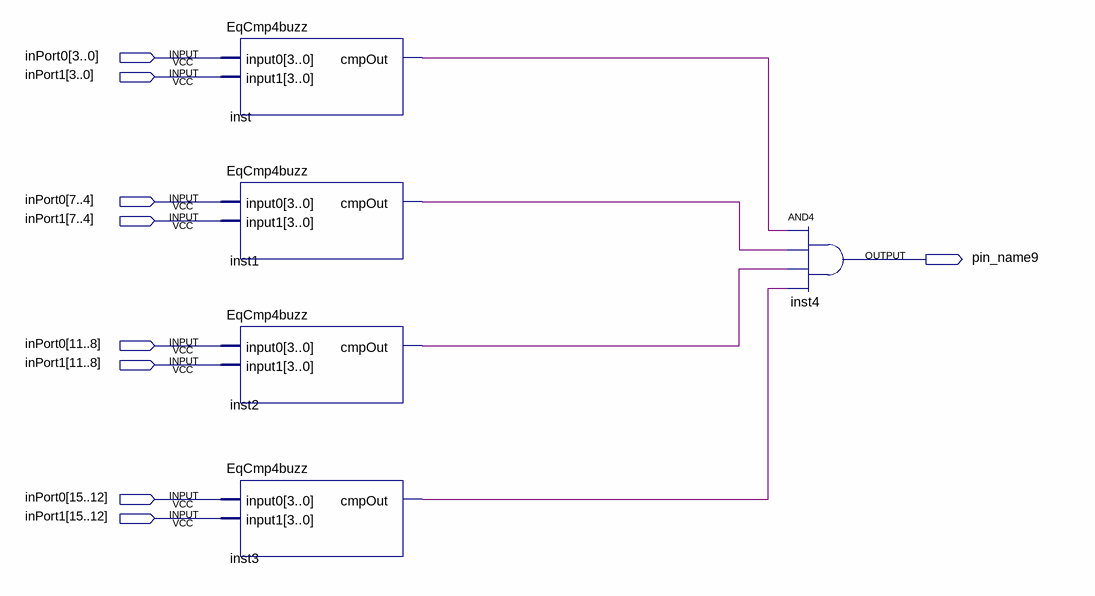
[diagram p0: schematic sheet]
// Quartus schematic EqCmp16Demo.bdf as structural Verilog: 5 symbols, 9 pins
module EqCmp16Demo (
  input  [15:0] inPort0,
  input  [15:0] inPort1,
  output pin_name9
);

  wire inst1_cmpout, inst2_cmpout, inst3_cmpout, inst_cmpout;

  EqCmp4buzz inst (.input0(inPort0[3:0]), .input1(inPort1[3:0]), .cmpOut(inst_cmpout));
  EqCmp4buzz inst1 (.input0(inPort0[7:4]), .input1(inPort1[7:4]), .cmpOut(inst1_cmpout));
  EqCmp4buzz inst2 (.input0(inPort0[11:8]), .input1(inPort1[11:8]), .cmpOut(inst2_cmpout));
  EqCmp4buzz inst3 (.input0(inPort0[15:12]), .input1(inPort1[15:12]), .cmpOut(inst3_cmpout));
  and inst4 (pin_name9, inst_cmpout, inst1_cmpout, inst2_cmpout, inst3_cmpout);
endmodule
